# EAGLE schematic main (EAGLE 6.5.0)
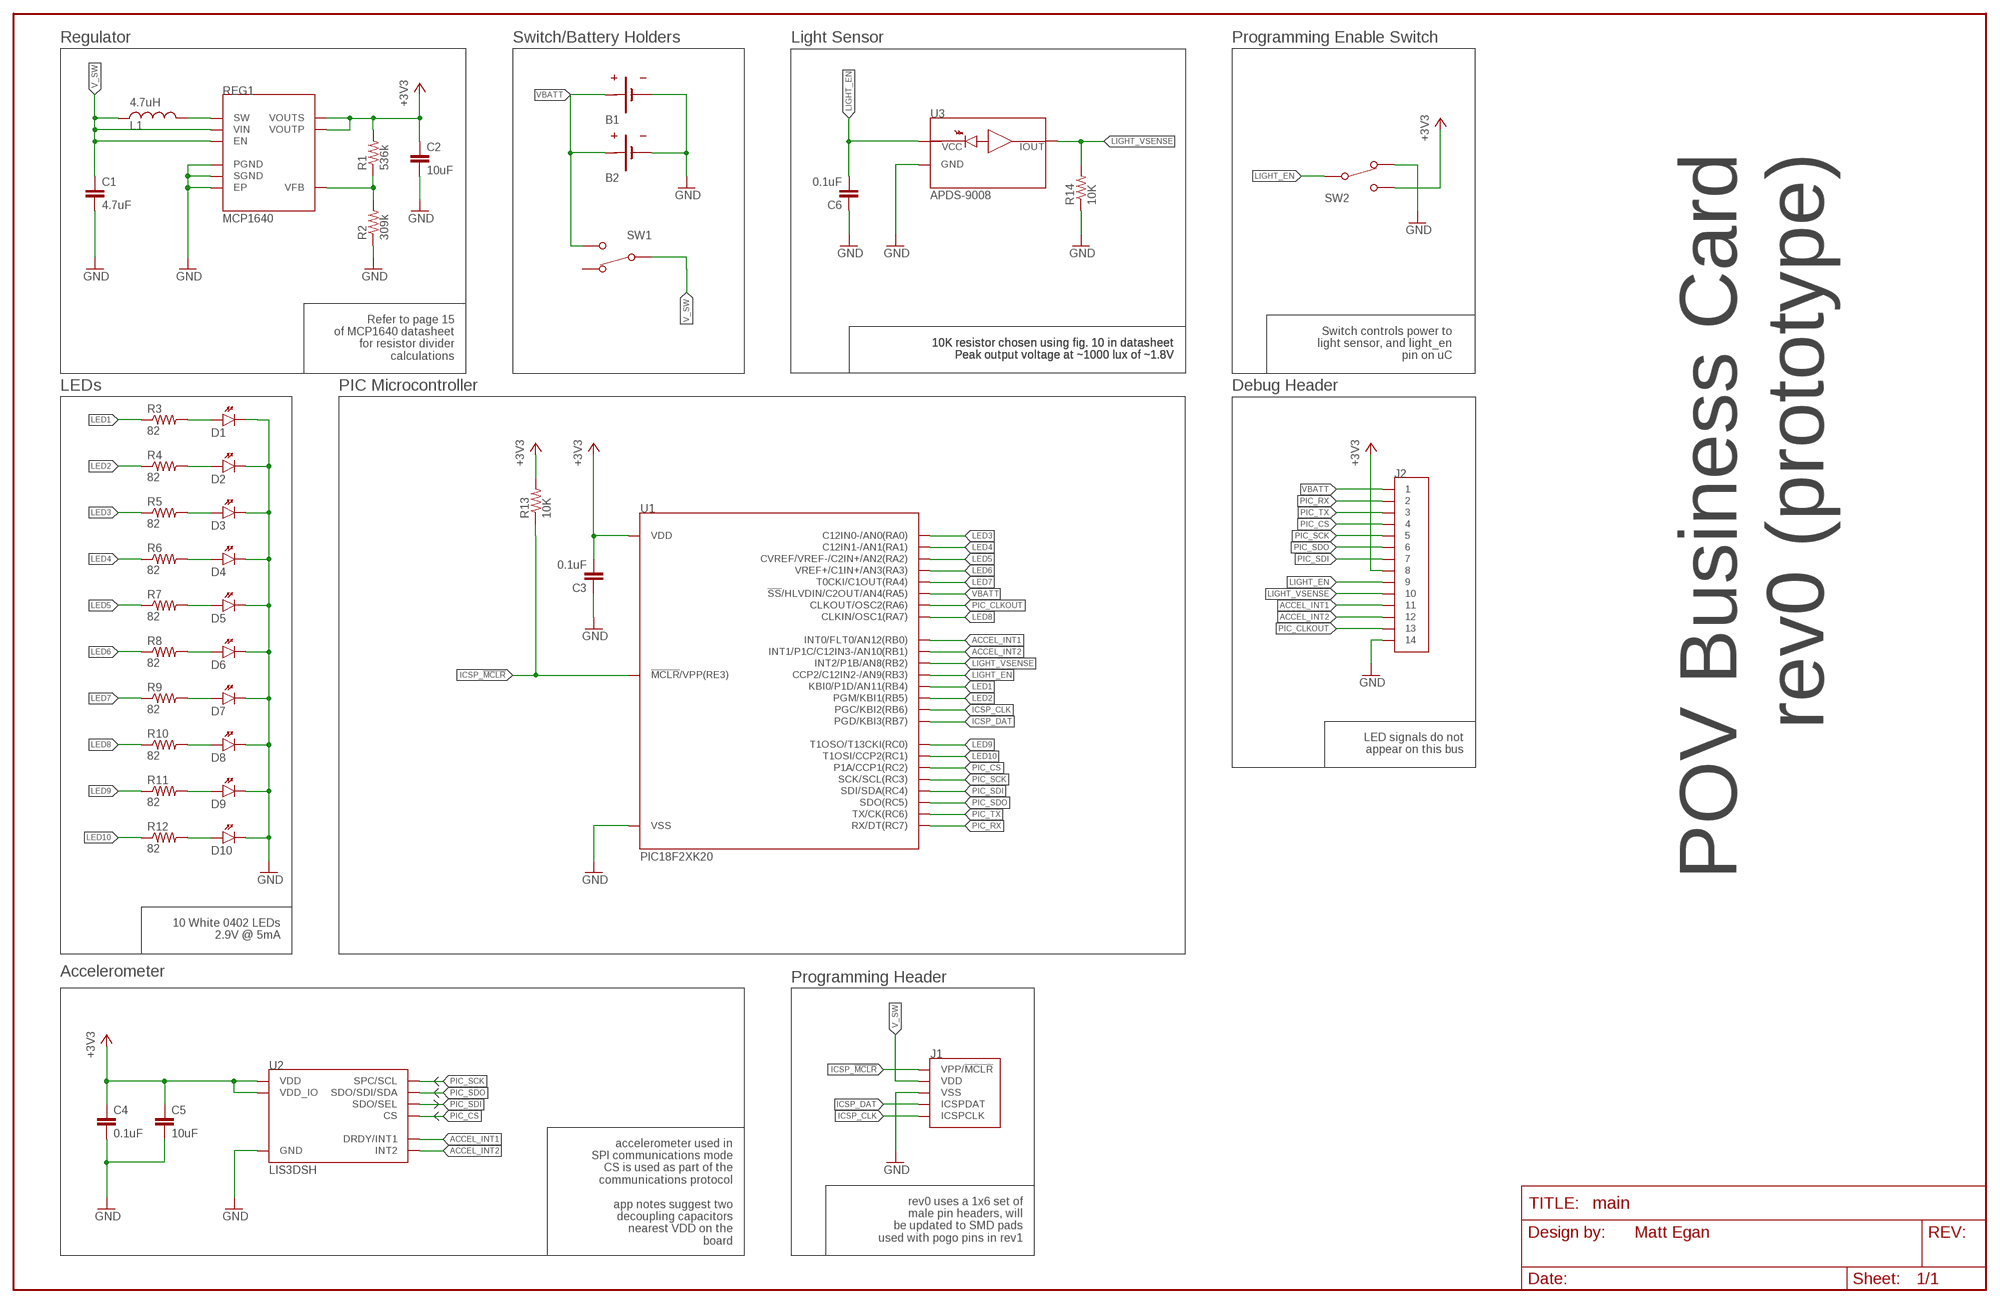
[diagram p0: schematic, sheet 1]

## Parts
B1  BATTERYKEYSTONE-3002  [KEYSTONE-3002]
B2  BATTERYKEYSTONE-3002  [KEYSTONE-3002]
C1  4.7uF  CAPACITOR0603  [SMD-0603]
C2  10uF  CAPACITOR0805  [SMD-0805]
C3  0.1uF  CAPACITOR0805  [SMD-0805]
C4  0.1uF  CAPACITOR0805  [SMD-0805]
C5  10uF  CAPACITOR0805  [SMD-0805]
C6  0.1uF  CAPACITOR0805  [SMD-0805]
D1  LED0402  [SMD-0402-P]
D2  LED0402  [SMD-0402-P]
D3  LED0402  [SMD-0402-P]
D4  LED0402  [SMD-0402-P]
D5  LED0402  [SMD-0402-P]
D6  LED0402  [SMD-0402-P]
D7  LED0402  [SMD-0402-P]
D8  LED0402  [SMD-0402-P]
D9  LED0402  [SMD-0402-P]
D10  LED0402  [SMD-0402-P]
J1  ICSP-HEADER  [1X6-0.1-ICSP]
J2  HEADER-14  [1X14-0.1]
L1  4.7uH  INDUCTOR  [VLF403210MT]
R1  536k  RESISTOR0603  [SMD-0603]
R2  309k  RESISTOR0603  [SMD-0603]
R3  82  RESISTOR0603  [SMD-0603]
R4  82  RESISTOR0603  [SMD-0603]
R5  82  RESISTOR0603  [SMD-0603]
R6  82  RESISTOR0603  [SMD-0603]
R7  82  RESISTOR0603  [SMD-0603]
R8  82  RESISTOR0603  [SMD-0603]
R9  82  RESISTOR0603  [SMD-0603]
R10  82  RESISTOR0603  [SMD-0603]
R11  82  RESISTOR0603  [SMD-0603]
R12  82  RESISTOR0603  [SMD-0603]
R13  10K  RESISTOR0603  [SMD-0603]
R14  10K  RESISTOR0603  [SMD-0603]
REG1  MCP1640  [DFN-8(2X3)]
SW1  JS102000SAQN  [JS102000SAQN]
SW2  JS102000SAQN  [JS102000SAQN]
U1  PIC18F2XK20  [QFN-28]
U2  LIS3DSH  [LGA-16]
U3  APDS-9008  [AVAGO-CHIPLED6]

## Nets
+3V3: C2.1 C3.2 C4.1 C5.1 J2.P$8 R1.2 R13.2 REG1.6(VOUTP) REG1.7(VOUTS) SW2.SW$3 U1.P$17(VDD) U2.P$1(VDD_IO) U2.P$14(VDD) U2.P$15(VDD)
ACCEL_INT1: J2.P$11 U1.P$18(INT0/FLT0/AN12(RB0)) U2.P$11(DRDY/INT1)
ACCEL_INT2: J2.P$12 U1.P$19(INT1/P1C/C12IN3-/AN10(RB1)) U2.P$9(INT2)
GND: B1.P$- B2.P$- C1.2 C2.2 C3.1 C4.2 C5.2 C6.1 D1.- D2.- D3.- D4.- D5.- D6.- D7.- D8.- D9.- D10.- J1.P$3(VSS) J2.P$14 R2.1 R14.1 REG1.2(SGND) REG1.3(PGND) REG1.EP SW2.SW$1 U1.P$5(VSS) U1.P$16(VSS) U2.P$5(GND) U2.P$10(GND) U2.P$12(GND) U2.P$13(GND) U2.P$16(GND) U3.P$4(GND)
ICSP_!MCLR!: J1.P$1(VPP/!MCLR!) R13.1 U1.P$26(!MCLR!/VPP(RE3))
ICSP_CLK: J1.P$5(ICSPCLK) U1.P$24(PGC/KBI2(RB6))
ICSP_DAT: J1.P$4(ICSPDAT) U1.P$25(PGD/KBI3(RB7))
LED1: R3.1 U1.P$22(KBI0/P1D/AN11(RB4))
LED2: R4.1 U1.P$23(PGM/KBI1(RB5))
LED3: R5.1 U1.P$27(C12IN0-/AN0(RA0))
LED4: R6.1 U1.P$28(C12IN1-/AN1(RA1))
LED5: R7.1 U1.P$1(CVREF/VREF-/C2IN+/AN2(RA2))
LED6: R8.1 U1.P$2(VREF+/C1IN+/AN3(RA3))
LED7: R9.1 U1.P$3(T0CKI/C1OUT(RA4))
LED8: R10.1 U1.P$6(CLKIN/OSC1(RA7))
LED9: R11.1 U1.P$8(T1OSO/T13CKI(RC0))
LED10: R12.1 U1.P$9(T1OSI/CCP2(RC1))
LIGHT_EN: C6.2 J2.P$9 SW2.SW$2 U1.P$21(CCP2/C12IN2-/AN9(RB3)) U3.P$1(P$VCC)
LIGHT_VSENSE: J2.P$10 R14.2 U1.P$20(INT2/P1B/AN8(RB2)) U3.P$6(P$IOUT)
N$3: L1.P$2 REG1.5(SW)
N$5: R1.1 R2.2 REG1.1(VFB)
N$7: D1.+ R3.2
N$8: D2.+ R4.2
N$9: D3.+ R5.2
N$10: D4.+ R6.2
N$11: D5.+ R7.2
N$12: D6.+ R8.2
N$13: D7.+ R9.2
N$14: D8.+ R10.2
N$15: D9.+ R11.2
N$16: D10.+ R12.2
PIC_CLKOUT: J2.P$13 U1.P$7(CLKOUT/OSC2(RA6))
PIC_CS: J2.P$4 U1.P$10(P1A/CCP1(RC2)) U2.P$8(CS)
PIC_RX: J2.P$2 U1.P$15(RX/DT(RC7))
PIC_SCK: J2.P$5 U1.P$11(SCK/SCL(RC3)) U2.P$4(SPC/SCL)
PIC_SDI: J2.P$7 U1.P$12(SDI/SDA(RC4)) U2.P$7(SDO/SEL)
PIC_SDO: J2.P$6 U1.P$13(SDO(RC5)) U2.P$6(SDO/SDI/SDA)
PIC_TX: J2.P$3 U1.P$14(TX/CK(RC6))
V_SW: C1.1 J1.P$2(VDD) L1.P$1 REG1.4(EN) REG1.8(VIN) SW1.SW$2
VBATT: B1.P$+(1)(P$+) B1.P$+(2)(P$+) B2.P$+(1)(P$+) B2.P$+(2)(P$+) J2.P$1 SW1.SW$3 U1.P$4(!SS!/HLVDIN/C2OUT/AN4(RA5))
Unconnected: SW1.SW$1

## Notes on the sheet
- Regulator | Switch/Battery Holders | Light Sensor | Programming Enable Switch
- POV Business Card
  rev0 (prototype)
- Refer to page 15
  of MCP1640 datasheet
  for resistor divider
  calculations
- Switch controls power to
  light sensor, and light_en
  pin on uC
- 10K resistor chosen using fig. 10 in datasheet
  Peak output voltage at ~1000 lux of ~1.8V
- 10K resistor chosen using fig. 10 in datasheet
  Peak output voltage at ~1000 lux of ~1.8V
- 10K resistor chosen using fig. 10 in datasheet
  Peak output voltage at ~1000 lux of ~1.8V
- LEDs | PIC Microcontroller | Debug Header
- LED signals do not
  appear on this bus
- 10 White 0402 LEDs
  2.9V @ 5mA
- Accelerometer
- Programming Header
- accelerometer used in
  SPI communications mode
  CS is used as part of the
  communications protocol
  
  app notes suggest two
  decoupling capacitors
  nearest VDD on the
  board
- rev0 uses a 1x6 set of
  male pin headers, will
  be updated to SMD pads
  used with pogo pins in rev1
- Matt Egan

## Library data of the parts
B1 B2 = matt:BATTERY: Various battery holders and mounts
C1-C6 = matt:CAPACITOR
D1-D10 = matt:LED
J1 = matt:ICSP-HEADER
J2 = matt:HEADER-14
L1 = matt:INDUCTOR
R1-R14 = matt:RESISTOR
REG1 = matt:MCP1640
SW1 SW2 = matt:JS102000SAQN: JS series sub-miniature slide switch SPTD, right angle surface mount, low profile
U1 = matt:PIC18F2XK20
U2 = matt:LIS3DSH
U3 = matt:APDS-9008